# EAGLE design duck (EAGLE 9.2.1)
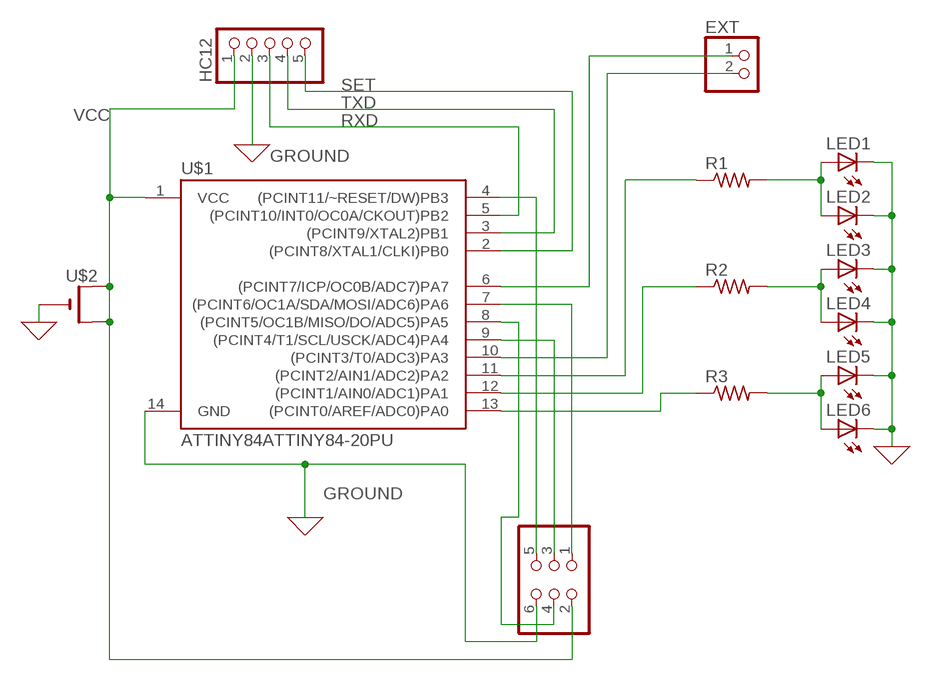
[diagram p0: schematic, sheet 1]

## Parts
DEV  PINHD-2X3  [2X03]
EXT  PINHD-1X2  [1X02]
HC12  PINHD-1X5  [1X05]
LED1  LED3MM  [LED3MM]
LED2  LED3MM  [LED3MM]
LED3  LED3MM  [LED3MM]
LED4  LED3MM  [LED3MM]
LED5  LED3MM  [LED3MM]
LED6  LED3MM  [LED3MM]
R1  R-US_0204/7  [0204/7]
R2  R-US_0204/7  [0204/7]
R3  R-US_0204/7  [0204/7]
U$1  ATTINY84ATTINY84-20PU  [DIP14]
U$2  CR1220THM  [CR1220-THM]

## Nets
GROUND: DEV.6 HC12.2 LED1.K(C) LED2.K(C) LED3.K(C) LED4.K(C) LED5.K(C) LED6.K(C) U$1.14(GND) U$2.- ; supply symbol labelled GND
N$1: DEV.1 U$1.7((PCINT6/OC1A/SDA/MOSI/ADC6)PA6)
N$3: DEV.4 U$1.8((PCINT5/OC1B/MISO/DO/ADC5)PA5)
N$4: DEV.3 U$1.9((PCINT4/T1/SCL/USCK/ADC4)PA4)
N$5: R1.1 U$1.11((PCINT2/AIN1/ADC2)PA2)
N$6: DEV.5 U$1.4((PCINT11/~RESET/DW)PB3)
N$7: R2.1 U$1.12((PCINT1/AIN0/ADC1)PA1)
N$8: R3.1 U$1.13((PCINT0/AREF/ADC0)PA0)
N$9: EXT.1 U$1.6((PCINT7/ICP/OC0B/ADC7)PA7)
N$10: LED1.A LED2.A R1.2
N$11: LED3.A LED4.A R2.2
N$12: EXT.2 U$1.10((PCINT3/T0/ADC3)PA3)
N$13: LED5.A LED6.A R3.2
RXD: HC12.3 U$1.5((PCINT10/INT0/OC0A/CKOUT)PB2)
SET: HC12.5 U$1.2((PCINT8/XTAL1/CLKI)PB0)
TXD: HC12.4 U$1.3((PCINT9/XTAL2)PB1)
VCC: DEV.2 HC12.1 U$1.1(VCC) U$2.+1(+) U$2.+2(+1)

## Library data of the parts
DEV = pinhead:PINHD-2X3: PIN HEADER
EXT = pinhead:PINHD-1X2: PIN HEADER
HC12 = pinhead:PINHD-1X5: PIN HEADER
LED1-LED6 = adafruit:LED: LED OSRAM: - CHIPLED LG R971, LG N971, LY N971, LG Q971, LY Q971, LO R971, LY R971 LH N974, LH R974 LS Q976, LO Q976, LY Q976 LO Q996 - Hyper CHIPLED LW Q18S LB Q993, LB Q99A, LB R99A - SideLED LS A670, LO A670, LY A670, LG A670, LP A670 LB A673, LV A673, LT A673, LW A673 LH A674 LY A675 LS A676, LA A676, LO A676, LY A676, LW A676 LS A679, LY A679, LG A679 - Hyper Micro SIDELED® LS Y876, LA Y876, LO Y876, LY Y876 LT Y87S - SmartLED LW L88C, LW L88S LB L89C, LB L89S, LG L890 LS L89K, LO L89K, LY L89K LS L896, LA L896, LO L896, LY L896 - TOPLED LS T670, LO T670, LY T670, LG T670, LP T670 LSG T670, LSP T670, LSY T670, LOP T670, LYG T670 LG T671, LOG T671, LSG T671 LB T673, LV T673, LT T673, LW T673 LH T674 LS T676, LA T676, LO T676, LY T676, LB T676, LH T676, LSB T676, LW T676 LB T67C, LV T67C, LT T67C, LS T67K, LO T67K, LY T67K, LW E67C LS E67B, LA E67B, LO E67B, LY E67B, LB E67C, LV E67C, LT E67C LW T67C LS T679, LY T679, LG T679 LS T770, LO T770, LY T770, LG T770, LP T770 LB T773, LV T773, LT T773, LW T773 LH T774 LS E675, LA E675, LY E675, LS T675 LS T776, LA T776, LO T776, LY T776, LB T776 LHGB T686 LT T68C, LB T68C - Hyper Mini TOPLED® LB M676 - Mini TOPLED Santana® LG M470 LS M47K, LO M47K, LY M47K Source: http://www.osram.convergy.de/
R1-R3 = adafruit:R-US_: RESISTOR, American symbol
U$1 = SparkFun-IC-Microcontroller:ATTINY84: Atmel 14-pin 2/4/8kB flash uC Datasheet <https://cdn.sparkfun.com/datasheets/Widgets/doc8006.pdf> SparkFun Products Tiny AVR Programmer <https://www.sparkfun.com/products/11801> (PGM-11801) SparkFun Servo Trigger - Continuous Rotation <https://www.sparkfun.com/products/13872> (WIG-13872) SparkFun Servo Trigger <https://www.sparkfun.com/products/13118> (WIG-13118)
U$2 = adafruit:CR1220: CR1216/CR1220/CR1225 12mm 3V lithium coin cell Great for battery packup. Both SMT and THM holders. Note the THM package has the ground pads on both sides of the PCB so that the masks are the same - this reduces the cost

## Board
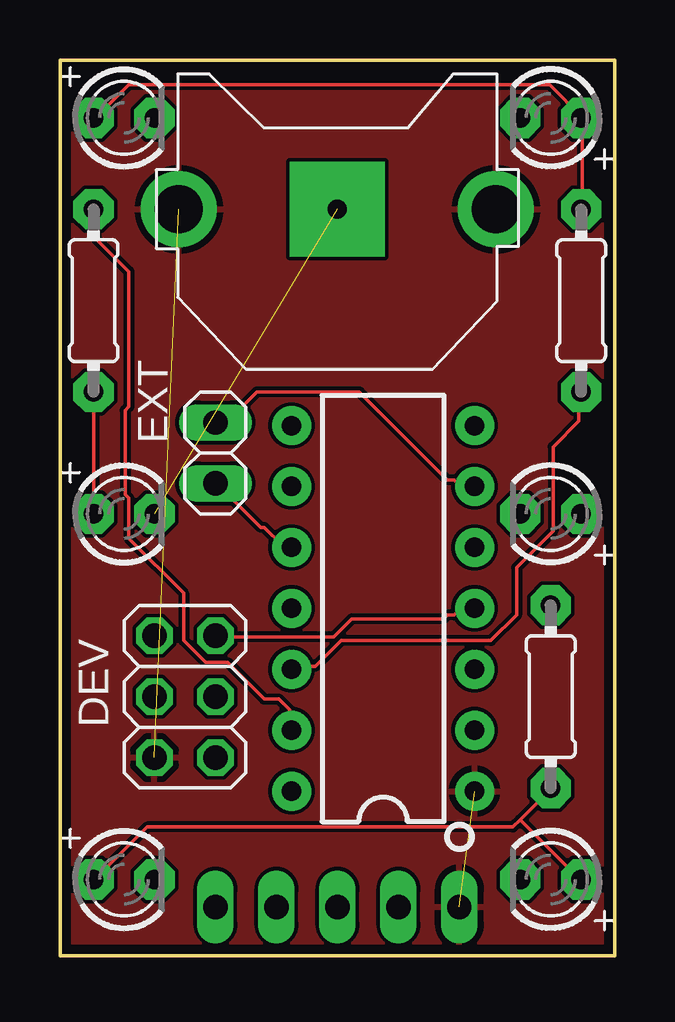
[diagram p1: board, top side]
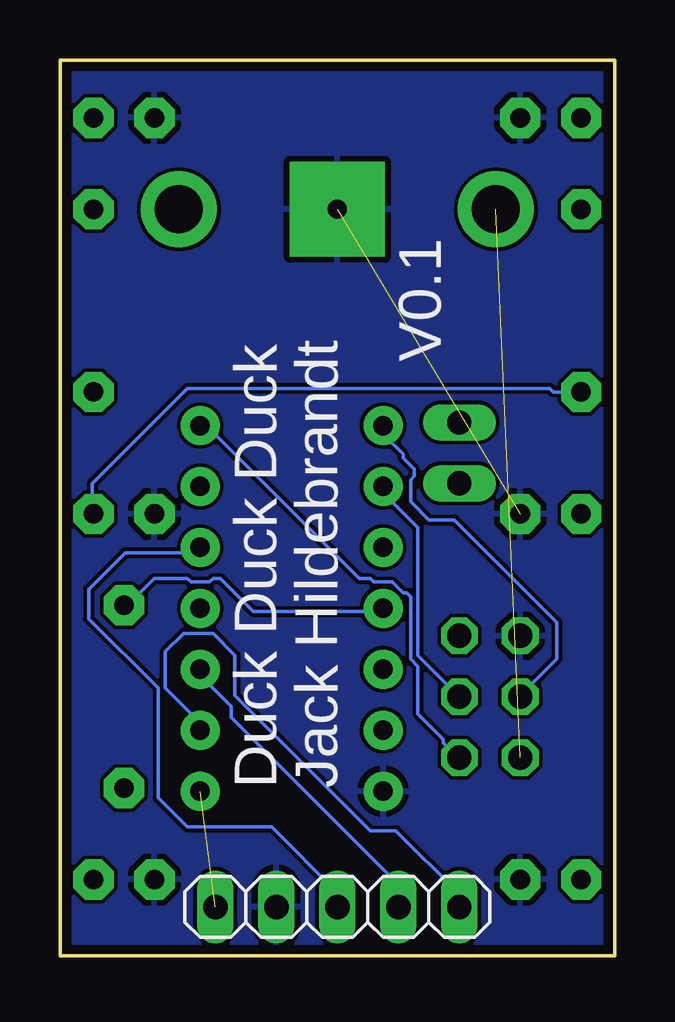
[diagram p2: board, bottom side, seen from below]

Size 23.11 x 37.34 mm. Coordinates in mm from the lower left corner, seen from the top.
Outline: 0,0 0,37.34 23.11,37.34 23.11,0 0,0
Copper layers (1*16): Top 0.035559375mm / dielectric 1.6mm / Bottom 0.035559375mm
Design rules "oshpark-2layer": minimum track width 6mil, minimum drill 10mil, track to track 6mil, track to pad 6mil, pad to pad 6mil, via to via 6mil, smd to smd 6mil, copper to edge 15mil, drill to drill 6mil, minimum pad ring 5mil, minimum via ring 5mil, stop-mask expansion 2.5mil, vias tented up to drill 0mil, thermal gap 10mil

### Footprints (pad centres in the part's own frame; a part is rotated, then mirrored left to right if it is on the bottom)
2X03 = drill 1.016 octagon: 1 -2.54,-1.27; 2 -2.54,1.27; 3 0,-1.27; 4 0,1.27; 5 2.54,-1.27; 6 2.54,1.27
1X02 = drill 1.016 long: 1 -1.27,0; 2 1.27,0
1X05 = drill 1.016 long: 1 -5.08,0; 2 -2.54,0; 3 0,0; 4 2.54,0; 5 5.08,0
LED3MM = drill 0.813 pad 1.676 octagon: A -1.27,0; K 1.27,0
0204/7 = drill 0.813 pad 1.676 octagon: 1 -3.81,0; 2 3.81,0
DIP14 = drill 0.813 pad 1.626: 1 -7.62,-3.81; 2 -5.08,-3.81; 3 -2.54,-3.81; 4 0,-3.81; 5 2.54,-3.81; 6 5.08,-3.81; 7 7.62,-3.81; 8 7.62,3.81; 9 5.08,3.81; 10 2.54,3.81; 11 0,3.81; 12 -2.54,3.81; 13 -5.08,3.81; 14 -7.62,3.81
CR1220-THM = drill 2 pad 3.175: +1 -6.604,0; +2 6.604,0 | drill 0.8 pad 3.962 square: - 0,0

### Placement (x,y rotation side)
DEV  5.21,10.8 90 top
EXT  6.48,20.95 270 top
HC12  11.56,2.03 0 bottom
LED1  20.45,3.17 180 top
LED2  2.67,3.17 0 top
LED3  2.67,34.92 0 top
LED4  20.45,34.92 180 top
LED5  2.67,18.42 0 top
LED6  20.45,18.42 180 top
R1  20.45,10.8 270 top
R2  21.72,27.3 90 top
R3  1.4,27.3 270 top
U$1  13.46,14.48 90 top
U$2  11.56,31.11 0 top

### Tracks (layer width: path | path; a pad name or v marks a point on that pad's centre or on a via)
GROUND  (1 unrouted)
  pour Bottom: -1.14,-1.91 -1.14,41.28 24.26,41.28 24.26,-1.91
N$1
  Bottom 0.152: DEV.1 6.53,8.25 7.14,8.86 7.14,9.02 8.2,10.08 8.2,12.06 8.51,12.37 8.51,14.96 8.66,15.11 8.81,15.11 9.27,15.57 10.03,15.57 10.19,15.72 10.64,15.72 16.89,21.97 17.2,21.97 U$1.7
N$3
  Bottom 0.152: DEV.4 3.94,10.85 2.41,12.37 2.41,13.89 6.68,18.16 7.75,18.16 8.51,18.92 8.51,19.84 8.36,19.99 8.36,20.3 8.81,20.75 8.81,20.9 9.58,21.67 9.58,21.97 U$1.8
N$4
  Bottom 0.152: DEV.3 8.2,12.52 8.2,17.86 9.58,19.23 9.58,19.53 U$1.9
N$5
  Bottom 0.152: U$1.11 9.73,14.35 15.06,14.35 16.43,15.72 16.74,15.72 16.89,15.57 17.65,15.57 17.81,15.72 19.18,15.72 20.4,14.5 R1.1
  Bottom 0.203: 20.32,14.48 R1.1
N$6
  Top 0.152: DEV.5 6.53,13.28 11.41,13.28 12.17,14.05 15.98,14.05 16.13,14.2 16.43,14.2 16.59,14.35 17.2,14.35 U$1.4
N$7
  Top 0.152: U$1.12 9.73,12.06 10.64,12.06 11.71,13.13 17.96,13.13 19.03,14.2 19.03,16.18 20.55,17.7 20.55,21.21 21.61,22.28 21.61,23.5 R2.1
N$8
  Top 0.152: U$1.13 9.58,9.47 9.58,10.24 9.12,10.69 8.51,10.69 6.99,12.22 6.07,12.22 5.16,13.13 5.16,15.11 2.87,17.4 2.87,19.08 2.72,19.23 2.72,22.73 2.87,22.89 2.87,28.52 1.5,29.9 1.5,31.11 R3.1
N$9
  Top 0.152: EXT.1 6.53,22.28 6.99,22.28 8.2,23.5 12.47,23.5 16.13,19.84 16.43,19.84 16.59,19.69 17.2,19.69 U$1.6
N$10
  Top 0.152: 19.18,5.66 20.4,6.88 R1.2 | 19.18,5.66 18.87,5.36 3.63,5.36 1.5,3.23 LED2.A | 19.18,5.66 21.61,3.23 LED1.A
N$11
  Top 0.152: 21.77,34.92 21.77,31.11 R2.2 | 21.77,34.92 20.4,36.3 2.87,36.3 1.5,34.92 LED3.A | 21.77,34.92 LED4.A
N$12
  Top 0.152: EXT.2 6.53,19.69 8.36,17.86 8.51,17.86 9.27,17.09 9.58,17.09 U$1.10
N$13
  Top 0.152: R3.2 LED5.A
  Bottom 0.152: R3.2 2.57,23.5 2.72,23.65 17.81,23.65 21.77,19.69 21.77,18.47 LED6.A
RXD
  Bottom 0.152: HC12.3 11.56,2.62 14.3,5.36 17.81,5.36 19.03,6.58 19.03,11.15 21.92,14.05 21.92,15.27 20.4,16.79 17.35,16.79 U$1.5
  Bottom 0.203: 17.27,16.51 U$1.5
SET
  Bottom 0.152: HC12.5 6.53,2.16 6.53,2.62 9.12,5.21 10.19,5.21 15.82,10.85 15.82,12.52 16.74,13.44 17.96,13.44 18.72,12.67 18.72,11.15 17.35,9.78 17.35,9.47 U$1.2
TXD
  Bottom 0.152: HC12.4 9.12,2.16 9.12,3.07 15.98,9.93 15.98,10.39 17.2,11.61 17.2,11.91 U$1.3
VCC  (2 unrouted)
  pour Top: -1.14,41.28 24.26,41.28 24.26,-1.91 -1.14,-1.91

### Text on the board
bNames: V0.1 | Jack Hildebrandt | Duck Duck Duck